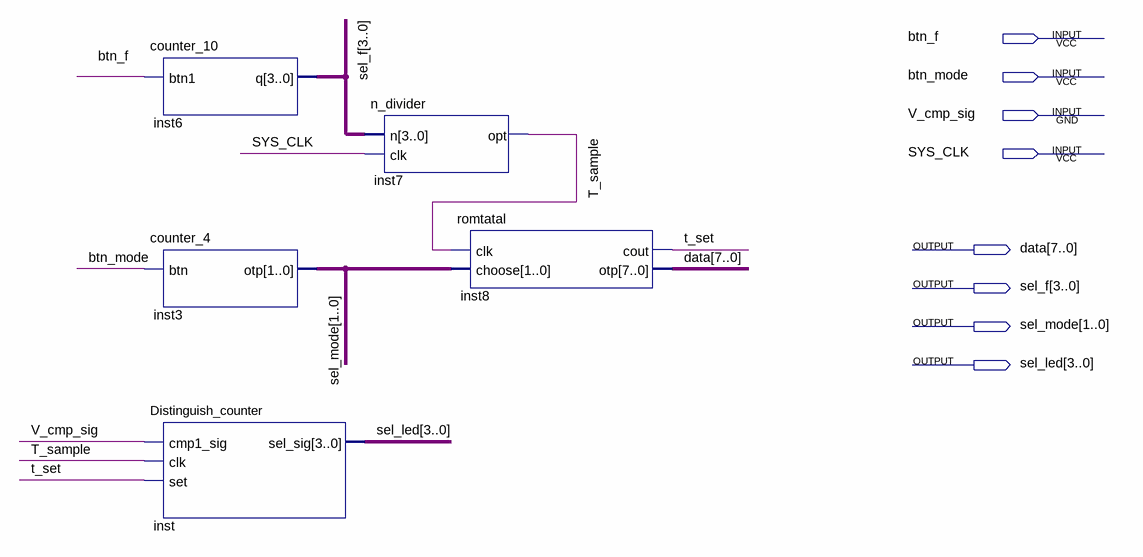
[diagram p0: schematic sheet]
// Quartus schematic SHUDIAN_PLUS.bdf as structural Verilog: 5 symbols, 8 pins
module SHUDIAN_PLUS (
  input  btn_f,
  input  btn_mode,
  input  V_cmp_sig,
  input  SYS_CLK,
  output [7:0] data,
  output [3:0] sel_f,
  output [1:0] sel_mode,
  output [3:0] sel_led
);

  wire T_sample, t_set;

  counter_10 inst6 (.btn1(btn_f), .q(sel_f));
  counter_4 inst3 (.btn(btn_mode), .otp(sel_mode));
  Distinguish_counter inst (.cmp1_sig(V_cmp_sig), .clk(T_sample), .set(t_set), .sel_sig(sel_led));
  n_divider inst7 (.n(sel_f), .clk(SYS_CLK), .opt(T_sample));
  romtatal inst8 (.clk(T_sample), .choose(sel_mode), .cout(t_set), .otp(data));
endmodule
